# EAGLE schematic BioBox (EAGLE 7.4.0)
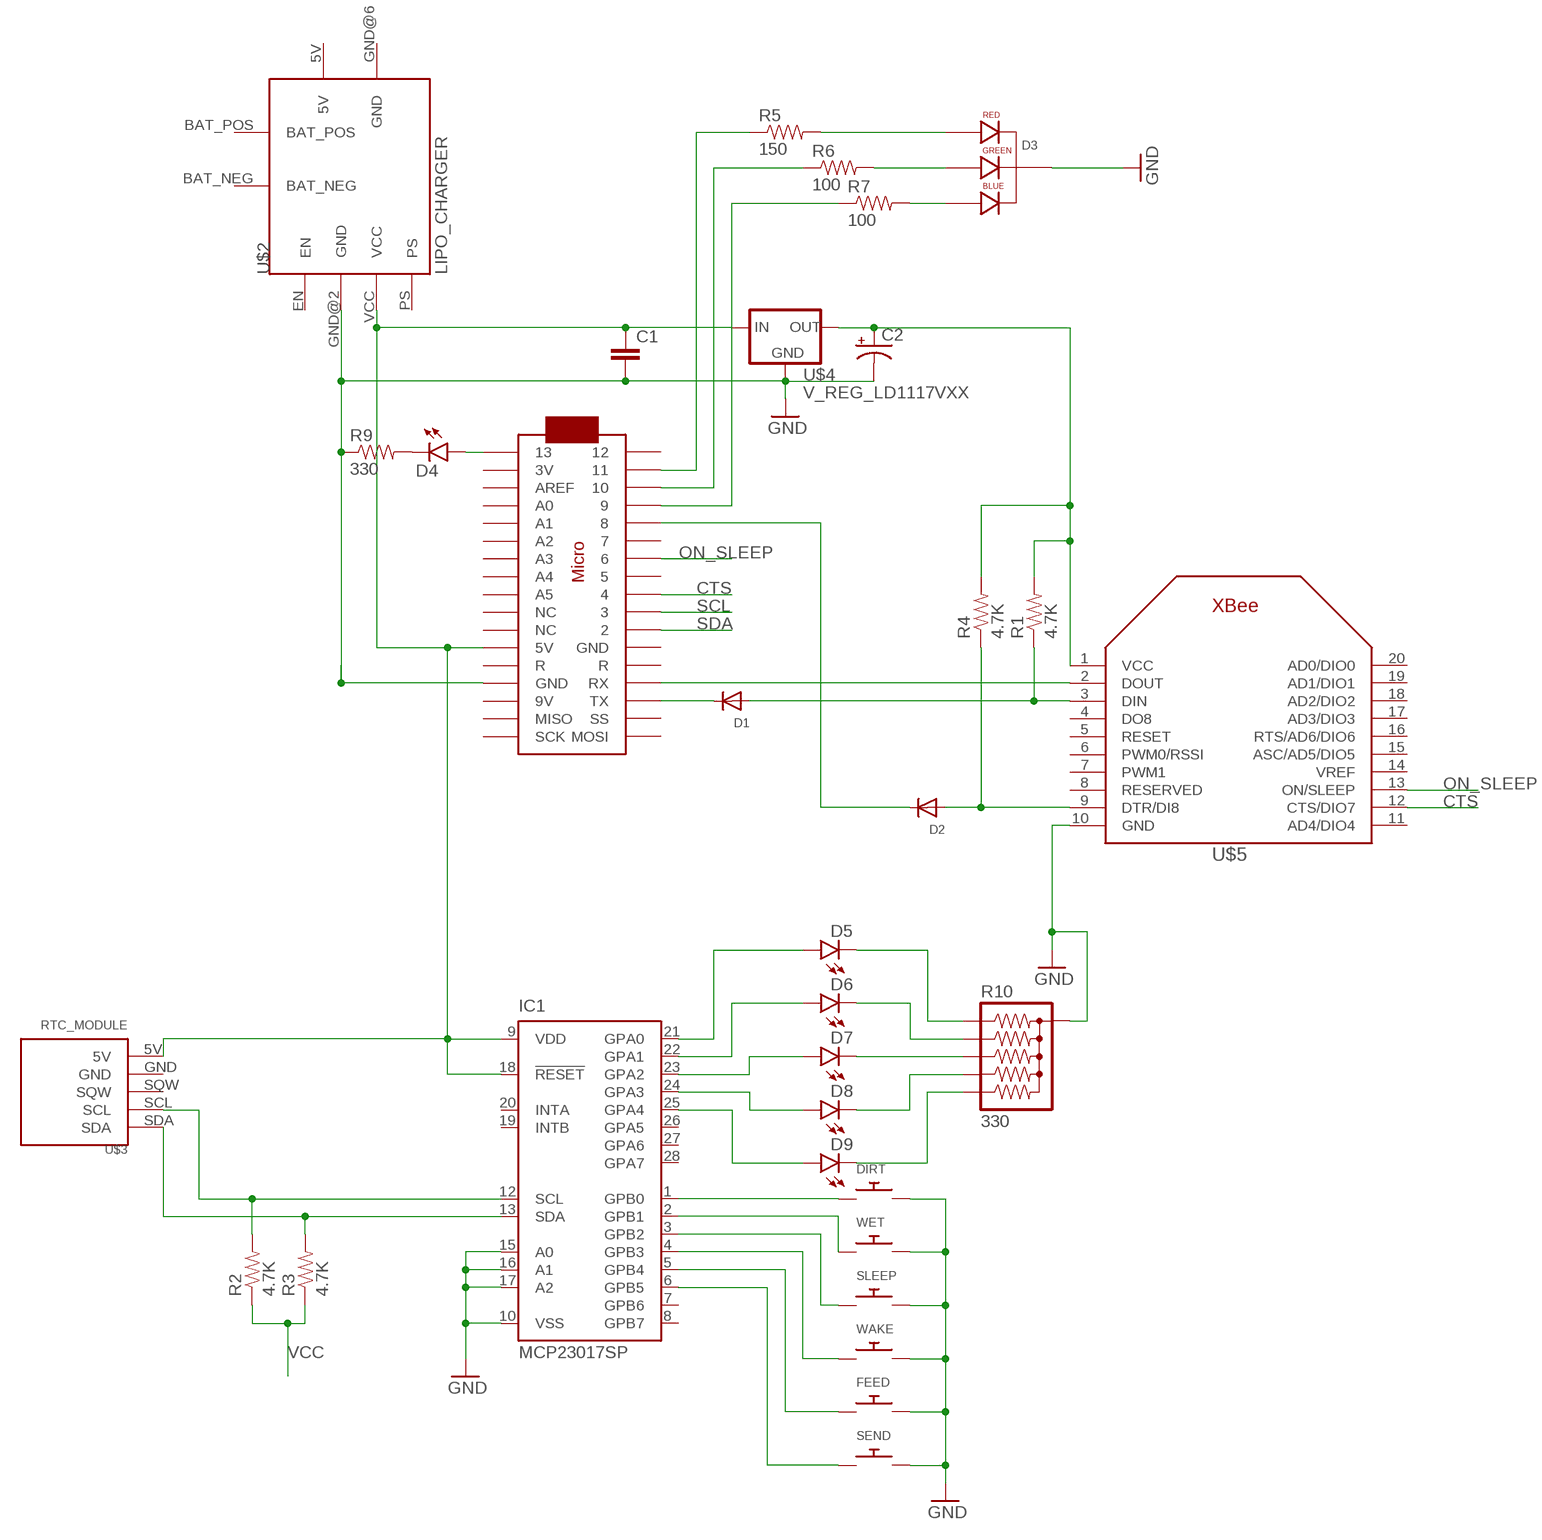
[diagram p0: schematic, sheet 1]

## Parts
C1  CAPPTH  [CAP-PTH-SMALL]
C2  CAP_POLPTH1  [CPOL-RADIAL-100UF-25V]
D1  DIODEDO-1N4148  [DO-1N4148]
D2  DIODEDO-1N4148  [DO-1N4148]
D3  LED-RGB-CC-THRUDIFFUSE  [LED-RGB-THRU]
D4  LED5MM  [LED5MM]
D5  LED5MM  [LED5MM]
D6  LED5MM  [LED5MM]
D7  LED5MM  [LED5MM]
D8  LED5MM  [LED5MM]
D9  LED5MM  [LED5MM]
DIRT  SWITCH_PUSHBUTTONSOFTTOUCHSMD_SJ  [PUSHBUTTON_SMD_SJ]
FEED  SWITCH_PUSHBUTTONSOFTTOUCHSMD_SJ  [PUSHBUTTON_SMD_SJ]
IC1  MCP23017SP  [DIL28-3]
R1  4.7K  RESISTORPTH-1/4W  [AXIAL-0.4]
R2  4.7K  RESISTORPTH-1/4W  [AXIAL-0.4]
R3  4.7K  RESISTORPTH-1/4W  [AXIAL-0.4]
R4  4.7K  RESISTORPTH-1/4W  [AXIAL-0.4]
R5  150  RESISTORPTH-1/4W  [AXIAL-0.4]
R6  100  RESISTORPTH-1/4W  [AXIAL-0.4]
R7  100  RESISTORPTH-1/4W  [AXIAL-0.4]
R9  330  RESISTORPTH-1/4W  [AXIAL-0.4]
R10  330  RPACK-BUSSED-SIP-PTH-5  [RPACK-SIP-PTH-5]
SEND  SWITCH_PUSHBUTTONSOFTTOUCHSMD_SJ  [PUSHBUTTON_SMD_SJ]
SLEEP  SWITCH_PUSHBUTTONSOFTTOUCHSMD_SJ  [PUSHBUTTON_SMD_SJ]
U$1  ARDUINOMICRO  [ARDUINOMICRO]
U$2  LIPO_CHARGER  [SF_LIPO_CHARGER]
U$3  RTC_MODULE  [RTC_MODULE]
U$4  V_REG_LD1117VXX  [78XXL]
U$5  XBEE  [XBEE]
WAKE  SWITCH_PUSHBUTTONSOFTTOUCHSMD_SJ  [PUSHBUTTON_SMD_SJ]
WET  SWITCH_PUSHBUTTONSOFTTOUCHSMD_SJ  [PUSHBUTTON_SMD_SJ]

## Nets
CTS: U$1.P$9 U$5.12(CTS/DIO7)
GND: C1.2 C2.2(-) D3.2(CATHODE) DIRT.P$2 FEED.P$2 IC1.10(VSS) IC1.15(A0) IC1.16(A1) IC1.17(A2) R9.P$1 R10.P$1 SEND.P$2 SLEEP.P$2 U$1.P$12(GND) U$2.GND@2(GND) U$4.IN(GND) U$5.10(GND) WAKE.P$2 WET.P$2
N$1: D2.A R4.P$1 U$5.9(DTR/DI8)
N$2: D2.C U$1.P$5
N$3: D1.C U$1.P$15(TX)
N$4: C1.1 IC1.9(VDD) IC1.18(!RESET) U$1.P$23(5V) U$2.VCC U$3.5V U$4.OUT(IN)
N$5: D1.A R1.P$1 U$5.3(DIN)
N$6: U$1.P$14(RX) U$5.2(DOUT)
N$7: R7.P$1 U$1.P$4
N$8: R6.P$1 U$1.P$3
N$9: R5.P$1 U$1.P$2
N$10: D3.1(RED_CATHODE) R5.P$2
N$11: D3.3(GREEN_CATHODE) R6.P$2
N$12: D3.4(BLUE_CATHODE) R7.P$2
N$13: DIRT.P$1 IC1.1(GPB0)
N$14: IC1.2(GPB1) WET.P$1
N$15: IC1.3(GPB2) SLEEP.P$1
N$16: IC1.4(GPB3) WAKE.P$1
N$17: FEED.P$1 IC1.5(GPB4)
N$18: IC1.6(GPB5) SEND.P$1
N$21: D4.K(C) R9.P$2
N$23: D4.A U$1.P$34
N$24: D5.A IC1.21(GPA0)
N$25: D6.A IC1.22(GPA1)
N$26: D7.A IC1.23(GPA2)
N$27: D8.A IC1.24(GPA3)
N$28: D9.A IC1.25(GPA4)
N$29: D5.K(C) R10.P$2
N$30: D6.K(C) R10.P$3
N$31: D7.K(C) R10.P$4
N$32: D8.K(C) R10.P$5
N$33: D9.K(C) R10.P$6
ON_SLEEP: U$1.P$7 U$5.13(ON/SLEEP)
SCL: IC1.12(SCL) R2.P$2 U$1.P$10 U$3.SCL
SDA: IC1.13(SDA) R3.P$2 U$1.P$11 U$3.SDA
VCC: C2.1(+) R1.P$2 R2.P$1 R3.P$1 R4.P$2 U$4.GND(OUT) U$5.1(VCC)
Unconnected: IC1.7(GPB6) IC1.8(GPB7) IC1.19(INTB) IC1.20(INTA) IC1.26(GPA5) IC1.27(GPA6) IC1.28(GPA7) U$1.P$1 U$1.P$6 U$1.P$8 U$1.P$13(R) U$1.P$16(SS) U$1.P$17(MOSI) U$1.P$18(SCK) U$1.P$19(MISO) U$1.P$20(9V) U$1.P$21(GND) U$1.P$22(R) U$1.P$24(NC) U$1.P$25(NC) U$1.P$26(A5) U$1.P$27(A4) U$1.P$28(A3) U$1.P$29(A2) U$1.P$30(A1) U$1.P$31(A0) U$1.P$32(AREF) U$1.P$33(3V) U$2.5V U$2.BAT_NEG U$2.BAT_POS U$2.EN U$2.GND@6(GND) U$2.PS U$3.SQW U$5.4(DO8) U$5.5(RESET) U$5.6(PWM0/RSSI) U$5.7(PWM1) U$5.8(RESERVED) U$5.11(AD4/DIO4) U$5.14(VREF) U$5.15(ASC/AD5/DIO5) U$5.16(RTS/AD6/DIO6) U$5.17(AD3/DIO3) U$5.18(AD2/DIO2) U$5.19(AD1/DIO1) U$5.20(AD0/DIO0)

## Power pins joined to a net without a drawn wire
GND: U$3.GND

## Library data of the parts
C1 = SparkFun-Passives:CAP: Capacitor Standard 0603 ceramic capacitor, and 0.1" leaded capacitor.
C2 = SparkFun-Passives:CAP_POL: Capacitor Polarized These are standard SMD and PTH capacitors. Normally 10uF, 47uF, and 100uF in electrolytic and tantalum varieties. Always verify the external diameter of the through hole cap, it varies with capacity, voltage, and manufacturer. The EIA devices should be standard.
D1 D2 = adafruit:DIODE: Diode SMADIODE - SMA Surface Mount Package 20V 1A Schottky Diode Digikey: 641-1014-6-ND DO-1N4148 - Through Hole Small Current Diode SOD-123 20V 1 A (.5mV Vf) Schottky Diode - Digikey: MBRX120TPMSCT-ND SOD-323 10V 570mA (.38mV Vf, 3ns) Schottky Diode - Digikey: ZLLS410CT-ND SOD-523 30V 30mA Schottky Diode (RB751S-40TE61) - Digikey: RB751S-40TE61CT-ND SOT23-R/W - SOT23 Package (R = Solder Paste/Reflow Ovens, W = Hand-Soldering) BAT54Film 40V 300mA - Digikey: 497-7162-1-ND
D3 = SparkFun-LED:LED-RGB-CC-THRU: RGB Through-hole common cathode LED SparkFun Storefront: COM-00105 (Clear) COM-09264 (Diffuse); PROD_ID: DIO-09434
D4-D9 = SparkFun-LED:LED: LEDs Standard schematic elements and footprints for 5mm, 3mm, 1206, and 0603 sized LEDs. 5mm - Spark Fun Electronics SKU : COM-00529 (and others)
DIRT FEED SEND SLEEP WAKE WET = adafruit:SWITCH_PUSHBUTTON: Buttons SOFTTOUCHSMD_SJ - Soft touch temporary push button (Super Junk Akihabara) Compatible with SKPMANE010 [Mouser: 688-SKPMAN] C&K_KSS = Digikey: KSS221GLFS
IC1 = adafruit:MCP23017: http://ww1.microchip.com/downloads/en/DeviceDoc/21952a.pdf Source: http://ww1.microchip.com/downloads/en/DeviceDoc/21952a.pdf
R1-R7 R9 = SparkFun-Passives:RESISTOR: Resistor Basic schematic elements and footprints for 0603, 1206, and PTH resistors.
R10 = SparkFun-Passives:RPACK*: BOURNS 4600X series thick-film SIP resistor packs Five resistors bussed to a single pin (denoted by dot). 0.2W / resistor datasheet <http://dlnmh9ip6v2uc.cloudfront.net/datasheets/Components/General/4600x.pdf> SFE parts COM-10855 (330), COM-10856 (10K)
U$1 = adafruit:ARDUINOMICRO
U$2 = User-Submitted:LIPO_CHARGER
U$3 = User-Submitted:RTC_MODULE
U$4 = SparkFun-PowerIC:V_REG_LD1117VXX: LD1117VXX voltage regulator. We carry the 3.3V version (COM-00526) in TO-220 package.
U$5 = adafruit:XBEE